# Altium schematic sheet 5-2 fpga config.SchDoc
size A4; SheetNumber: 6; SheetTotal: 13
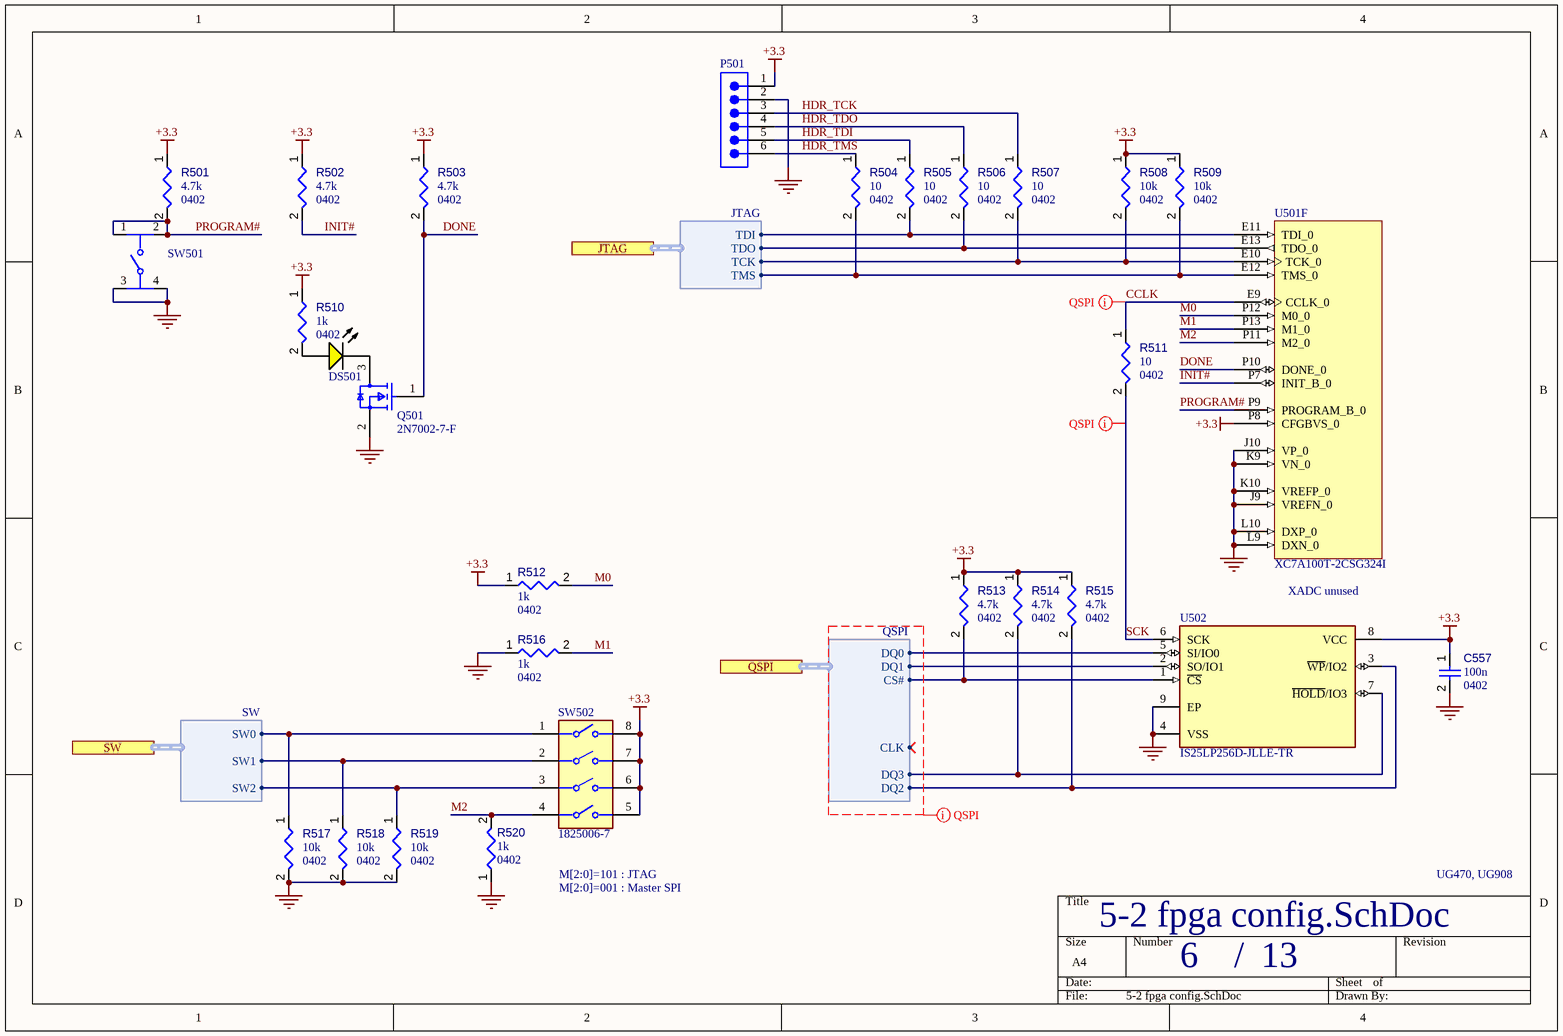
[diagram p0: 5-2 fpga config.SchDoc]

## Parts
C557  value 100n  Case/Package: 0402  [CAPC0402(1005)60_L]  (hidden comment: Capacitors,0402,100n,16)
DS501  SML-LX0603YW-TR  [LUMX-SML-LX0603_V]  (value not drawn)
P501  TSW-106-07-F-S  [SMTC-TSW-106-07-X-S]  (value not drawn)
Q501  2N7002-7-F  [FP-SOT23-MFG]
R501  value 4.7k  Case/Package: 0402  [RESC0402(1005)_L]  (hidden comment: Resistors,0402,4.7k)
R502  value 4.7k  Case/Package: 0402  [RESC0402(1005)_L]  (hidden comment: Resistors,0402,4.7k)
R503  value 4.7k  Case/Package: 0402  [RESC0402(1005)_L]  (hidden comment: Resistors,0402,4.7k)
R504  value 10  Case/Package: 0402  [RESC0402(1005)_L]  (hidden comment: Resistors,0402,10)
R505  value 10  Case/Package: 0402  [RESC0402(1005)_L]  (hidden comment: Resistors,0402,10)
R506  value 10  Case/Package: 0402  [RESC0402(1005)_L]  (hidden comment: Resistors,0402,10)
R507  value 10  Case/Package: 0402  [RESC0402(1005)_L]  (hidden comment: Resistors,0402,10)
R508  value 10k  Case/Package: 0402  [RESC0402(1005)_L]  (hidden comment: Resistors,0402,10k)
R509  value 10k  Case/Package: 0402  [RESC0402(1005)_L]  (hidden comment: Resistors,0402,10k)
R510  value 1k  Case/Package: 0402  [RESC0402(1005)_L]  (hidden comment: Resistors,0402,1k)
R511  value 10  Case/Package: 0402  [RESC0402(1005)_L]  (hidden comment: Resistors,0402,10)
R512  value 1k  Case/Package: 0402  [RESC0402(1005)_L]  (hidden comment: Resistors,0402,1k)
R513  value 4.7k  Case/Package: 0402  [RESC0402(1005)_L]  (hidden comment: Resistors,0402,4.7k)
R514  value 4.7k  Case/Package: 0402  [RESC0402(1005)_L]  (hidden comment: Resistors,0402,4.7k)
R515  value 4.7k  Case/Package: 0402  [RESC0402(1005)_L]  (hidden comment: Resistors,0402,4.7k)
R516  value 1k  Case/Package: 0402  [RESC0402(1005)_L]  (hidden comment: Resistors,0402,1k)
R517  value 10k  Case/Package: 0402  [RESC0402(1005)_L]  (hidden comment: Resistors,0402,10k)
R518  value 10k  Case/Package: 0402  [RESC0402(1005)_L]  (hidden comment: Resistors,0402,10k)
R519  value 10k  Case/Package: 0402  [RESC0402(1005)_L]  (hidden comment: Resistors,0402,10k)
R520  value 1k  Case/Package: 0402  [RESC0402(1005)_L]  (hidden comment: Resistors,0402,1k)
SW501  PTS810SJM250SMTRLFS  [FP-PTS810SJM250SMTRLFS-MFG]  (value not drawn)
SW502  1825006-7  [FP-1825006-7-MFG]
U501  XC7A100T-2CSG324I  [CSG324]  (part F of 9)
U502  IS25LP256D-JLLE-TR  [FP-PG-WSON-8-IPC_A]

## Ports
JTAG (harness JTAG), QSPI (harness QSPI), SW (harness SW)

## Harnesses
QSPI: DQ0, DQ1, DQ2, DQ3, CS#, CLK
JTAG: TCK, TDI, TDO, TMS
SW: SW1, SW0, SW2

## Nets
+3.3: C557.1 P501.1 R501.1 R502.1 R503.1 R508.1 R509.1 R510.1 R512.1 R513.1 R514.1 R515.1 SW502.5 SW502.6 SW502.7 SW502.8 U501.P8(CFGBVS_0) U502.8(VCC)
GND: C557.2 P501.2 Q501.2(S) R516.1 R517.2 R518.2 R519.2 R520.1 SW501.3 SW501.4 U501.J9(VREFN_0) U501.J10(VP_0) U501.K9(VN_0) U501.K10(VREFP_0) U501.L9(DXN_0) U501.L10(DXP_0) U502.4(VSS) U502.9(EP)
CCLK: R511.1 U501.E9(CCLK_0)
DONE: Q501.1(G) R503.2 U501.P10(DONE_0)
HDR_TCK: P501.3 R507.1
HDR_TDI: P501.5 R505.1
HDR_TDO: P501.4 R506.1
HDR_TMS: P501.6 R504.1
INIT#: R502.2 U501.P7(INIT_B_0)
M0: R512.2 U501.P12(M0_0)
M1: R516.2 U501.P13(M1_0)
M2: R520.2 SW502.4 U501.P11(M2_0)
PROGRAM#: R501.2 SW501.1 SW501.2 U501.P9(PROGRAM_B_0)
SCK: R511.2 U502.6(SCK)
NetDS501_1: DS501.1(A) R510.2
NetDS501_2: DS501.2(K) Q501.3(D)
NetR504_2: R504.2 R509.2 U501.E12(TMS_0) ; port JTAG.TMS
NetR505_2: R505.2 U501.E11(TDI_0) ; port JTAG.TDI
NetR506_2: R506.2 U501.E13(TDO_0) ; port JTAG.TDO
NetR507_2: R507.2 R508.2 U501.E10(TCK_0) ; port JTAG.TCK
NetR513_2: R513.2 U502.1(~{CS}) ; port QSPI.CS#
NetR514_2: R514.2 U502.7(~{HOLD}/IO3) ; port QSPI.DQ3
NetR515_2: R515.2 U502.3(~{WP}/IO2) ; port QSPI.DQ2
NetR517_1: R517.1 SW502.1 ; port SW.SW0
NetR518_1: R518.1 SW502.2 ; port SW.SW1
NetR519_1: R519.1 SW502.3 ; port SW.SW2
NetU502_2: U502.2(SO/IO1) ; port QSPI.DQ1
NetU502_5: U502.5(SI/IO0) ; port QSPI.DQ0

## Layout directives
net class QSPI: (no net found under the mark), CCLK, SCK

## Notes on the sheet
- XADC unused
- M[2:0]=101 : JTAG
- M[2:0]=001 : Master SPI
- UG470, UG908
- /

## Library data of the parts
C557 = Capacitors: Capacitor; Voltage Rating: 16; Component Type: Capacitors
DS501 = CMP-2000-07121-1: Yellow LED, Milky White Diffused Lens, 2.1 V, 14 mcd, -25 to 85 degC, 2-Pin SMD, RoHS, Tape and Reel; Manufacturer: Lumex; COO: CN; Number of LEDs: 1; Type: Uni-Color; Intensity: 14mcd; Reverse Voltage: 5(Min)V; LED Material: GaAsP; Viewing Angle: 160; Peak Wavelength: 585nm; Pin_Count: 2; Lens Appearance: ColorlessDiffused; Operating Temperature: -25to85C; Color: Yellow; Mounting Technology: SurfaceMount; Package Description: 2-Pin Surface Mount Device, Body 1.6 x 0.8 mm; Mounting: SurfaceMount; Packaging: TapeandReel; RoHS: Unknown; Supplier_Package: SMD; Package Reference: SML-LX00603; Part No: SML-LX0603YW-TR; Datasheet URL: http://www.lumex.com/content/files/ProductAttachment/SML-LX0603YW-TR.pdf; Dimension: 1.6x0.8x0.6mm; Manufacturer URL: http://www.lumexinstruments.com/; HTS: 8541402000; Datasheet Version: Rev. G, 09/2013; Lens Dimensions: 1x0.8x0.3mm; Dominant Wavelength: N/A; ECCN: EARII; Supplier: Lumex; Family: SML-LX0603YW
P501 = CMP-1024-00385-1: 0.025" SQ Post Header, Through-hole, Vertical, -55 to 125 degC, 2.54 mm Pitch, 6-Pin, Male, RoHS; Manufacturer: Samtec; Pitch: 2.54 mm; Orientation: Vertical; RoHS: True; ComponentLink3Description: Package Specification; PartNumber: TSW-106-07-F-S; Temperature Range: -55 to 125 degC; PackageVersion: DM, 8/1988; ComponentLink2URL: http://www.samtec.com/documents/webfiles/pdf/TSW_TH.PDF; ComponentLink1Description: Manufacturer URL; ComponentLink2Description: Datasheet; ComponentLink1URL: http://www.samtec.com; DatasheetVersion: F-214; PackageReference: TSW-106-07-X-S; PackageDescription: .025[0.64] SQ. Post Terminal Strip Assembly; ComponentLink3URL: http://www.samtec.com/documents/webfiles/cpdf/TSW-XXX-XX-XXX-X-XX-XXX-MKT.pdf; Mounting Technology: Through-hole
Q501 = CMP-2000-04929-2: MOSFET N-CH 60V 115MA SOT23-3; Turn-On Delay Time: 7ns; Turn-Off Delay Time: 11ns; Drain to Source Resistance: 7.5R; Rise Time: 3ns; Drain to Source Breakdown Voltage: 70V; Input Capacitance: 50pF; Number of Elements: 1; Power Dissipation: 540mW; Max Power Dissipation: 300mW; Fall Time: 5.6ns; Gate to Source Voltage (Vgs): 20V; Threshold Voltage: 2.5V; Element Configuration: Single; Termination: SMD/SMT; Weight: 0.000282oz; Radiation Hardening: No; Max Operating Temperature: 150°C; On-State Resistance: 7.5R; Mount: Surface Mount; Current Rating: 115mA; Contact Plating: Tin; Lead Free: Lead Free; Min Operating Temperature: -55°C; Number of Pins: 3; REACH SVHC: No SVHC; Drain to Source Voltage (Vdss): 60V; Width: 1.3mm; Package Quantity: 3000; Length: 2.9mm; Case/Package: SOT-23; Number of Channels: 1; Dual Supply Voltage: 60V; Packaging: Tape and Reel; Height: 1mm; Voltage Rating (DC): 60V; Nominal Vgs: 2.5V; Continuous Drain Current (ID): 115mA; Voltage: 60V; Rds On Max: 7.5R
R501-R520 = Resistors: Resistor; Component Type: Resistors
SW501 = CMP-10040-000001-2: SWITCH TACTILE SPST-NO 0.05A 16V; Throw Configuration: SPST; Operating Force: 160gf; Actuator Type: Standard; Switch Travel: 0.15mm; Switch Function: Off-Mom; Max Current Rating: 50mA; Mechanical Life: 150000Cycles; Illumination Type: Non-Illuminated; Package Quantity: 2900; Depth: 4.6mm; Mount: Surface Mount; Packaging: Tape and Reel; Length: 3.2mm; RoHS Compliant: Yes; Case/Package: SMD/SMT; Voltage Rating (DC): 16V; Min Operating Temperature: -40°C; Termination: J-Bend; Lead Free: Lead Free; Contact Plating: Silver; Orientation: Straight; Max Operating Temperature: 85°C; Current Rating: 50mA; Color: Black
SW502 = CMP-03400-000035-1: SWITCH SLIDE DIP SPST 25MA 24V; Sealable: Yes (With); Actuator Length: 0mm; Voltage Rating (DC): 50V; Electrical Life: 1000Cycles; Contact Current Rating: 100mA; Contact Resistance: 100mR; Number of Positions: 4; Actuator Type: Standard; Switching Capacity: 400mW; Actuator Material: Polymer; Pitch: 0.1inch; Washable: Yes; Contact Post Length: 0.169inch; Package Quantity: 40; Mount: Surface Mount; Height: 2.7mm; Flammability Rating: UL94 V-0; Length: 0.394inch; Max Current Rating: 25mA; Housing Material: Polyphenylene; Terminal Pitch: 2.54mm; Housing Color: Black; Series: GDS, Alcoswitch; Radiation Hardening: No; Throw Configuration: SPST; Max Voltage Rating (DC): 24V; Contact Material: Copper Alloy; Number of Circuits: 4; Number of Pins: 4; ELV: Compliant; Type: Switch; REACH SVHC: No SVHC; Lead Free: Lead Free; Depth: 9.3mm; Termination: Gull Wing; Width: 8.15mm; Orientation: Straight; Max Operating Temperature: 85°C; Contact Plating: Gold; Min Operating Temperature: -30°C; Packaging: Rail/Tube
U501 = CMP-0364-00002-3: Artix-7 FPGA, 210 User I/Os, 0 GTP, 324-Ball BGA, Speed Grade 2, Extended Grade, Pb-Free; Manufacturer: Xilinx; Block RAM Blocks (36Kb): 135; Logic Cells: 101440; Clock Mgmt Tiles (CMTs): 6; Block RAM Blocks (18Kb): 270; CLBs (Slices): 15850; Block RAM Blocks (Max Kb): 4860; Max User I/O: 300; Speed Grade: -2; DSP48E1 Slices: 240; ComponentLink5URL: http://www.xilinx.com/support/documentation/user_guides/ug475_7Series_Pkg_Pinout.pdf; ComponentLink4Description: Package File; PackageDescription: Wire-Bond Chip-Scale BGA, Body 15 x 15 mm, 0.8 mm Pitch; RoHS: Pb-Free; ComponentLink5Description: Packaging and Pinout; ComponentLink2URL: http://www.xilinx.com/support/documentation/user_guides/ug475_7Series_Pkg_Pinout.pdf; ComponentLink2Description: Package Specification; PartNumber: XC7A100T-2CSG324I; Mounting Technology: Surface Mount; ComponentLink3Description: DC and Switching Characteristics; PackageVersion: Rev 1.8; Code_JEDEC: MO-275-KKAC-1; PackageReference: CSG324; NexusDeviceID: XC7A100T-2CSG324I; ComponentLink4URL: http://www.xilinx.com/support/packagefiles/a7packages/xc7a100tcsg324pkg.txt; ComponentLink3URL: http://www.xilinx.com/support/documentation/data_sheets/ds181_Artix_7_Data_Sheet.pdf; ComponentLink1Description: Datasheet; DatasheetVersion: v1.12; ComponentLink1URL: http://www.xilinx.com/support/documentation/data_sheets/ds180_7Series_Overview.pdf; Generic Part Number: XC7A100T; CLBs (Max Distributed RAM Kb): 1188
U502 = CMP-00196-112300326-1: S25FL256SAGNFV000 128 Mbit (16 Mbyte)/256 Mbit (32 Mbyte) 3.0V SPI Flash Memory; NexarPartId: 112300326